# EAGLE design relay_5channel (EAGLE 9.6.1)
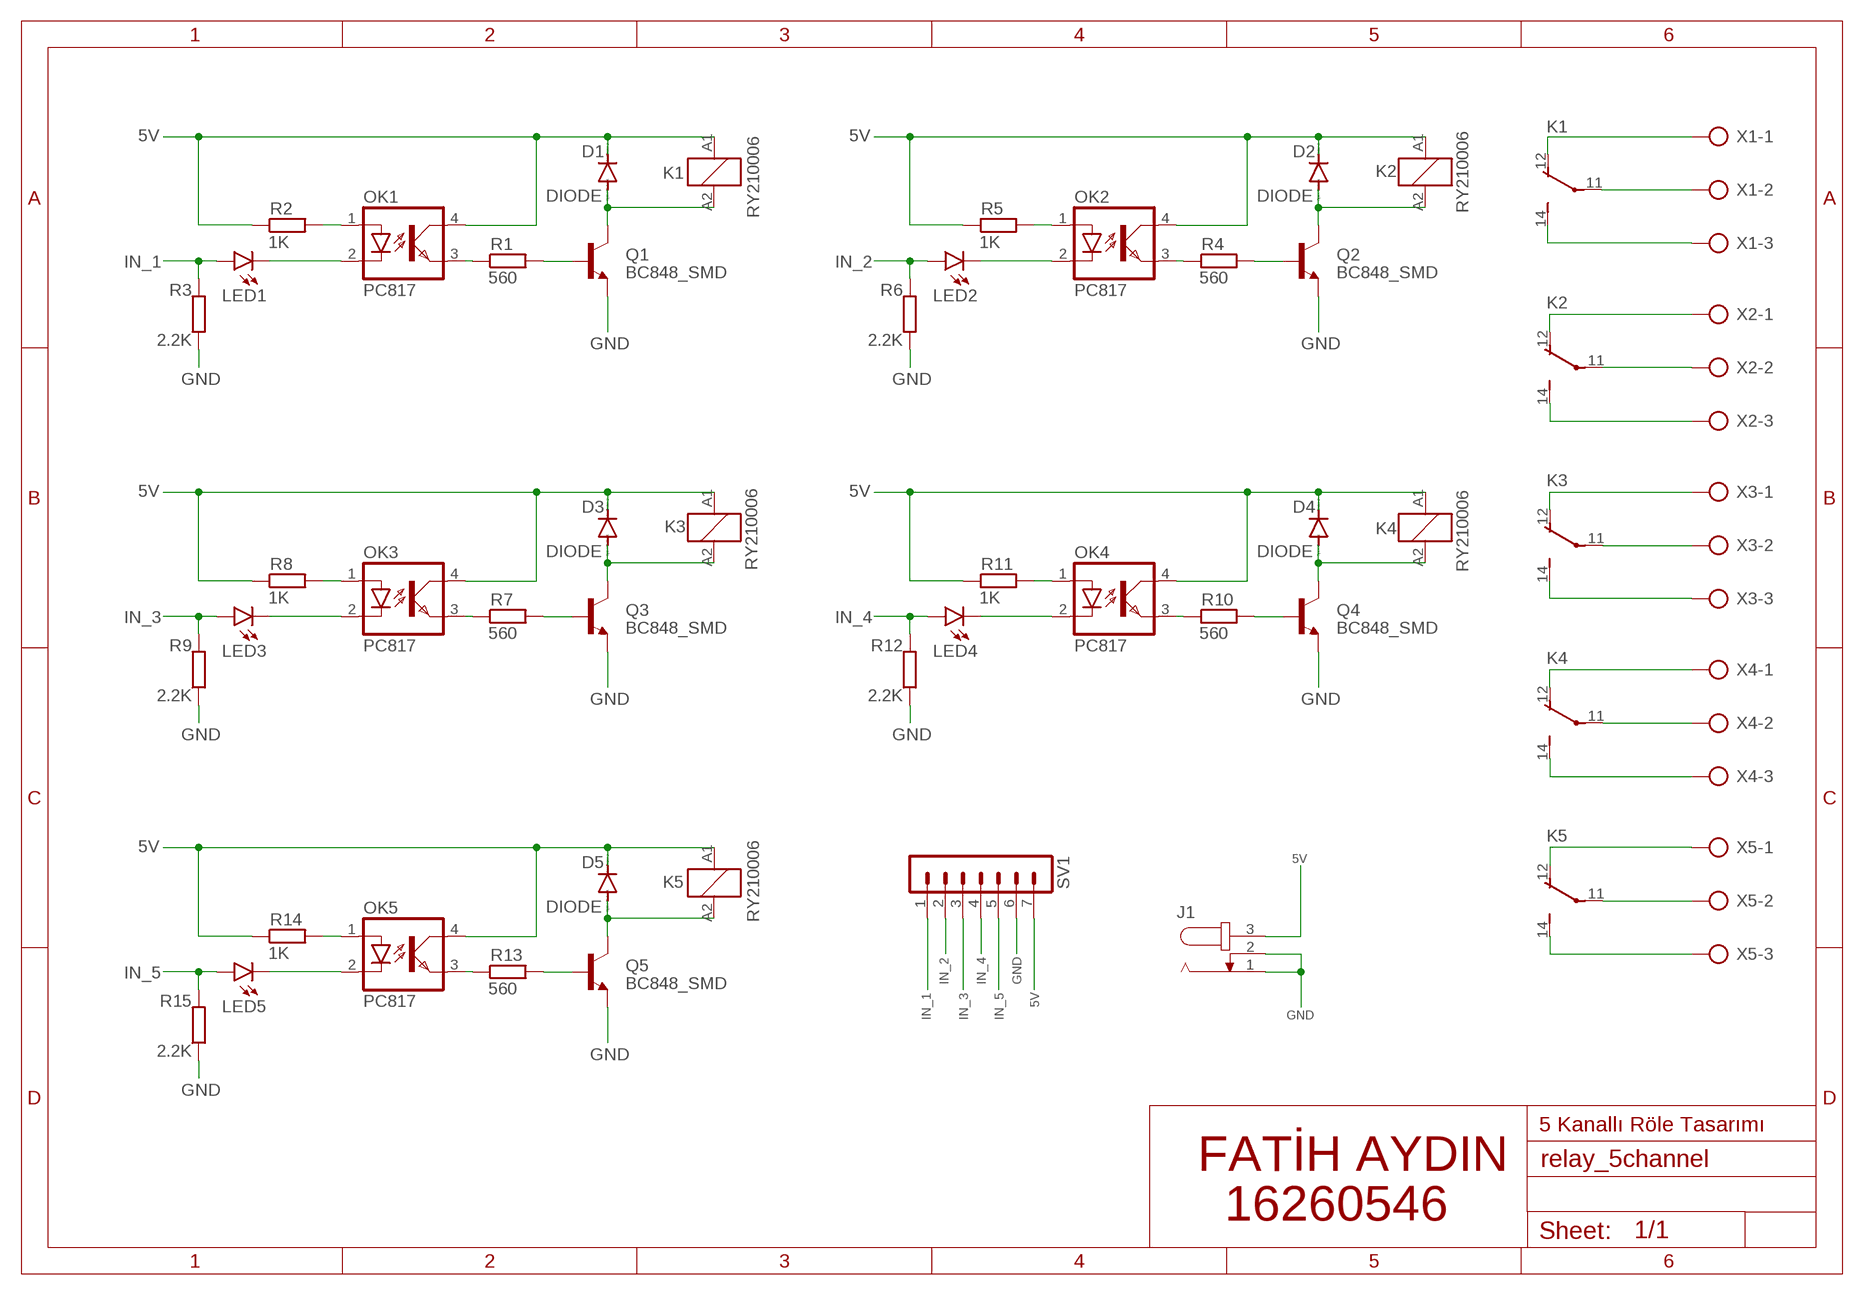
[diagram p0: schematic, sheet 1]

## Parts
D1  DIODE  1N4148DO35-7  [DO35-7]
D2  DIODE  1N4148DO35-7  [DO35-7]
D3  DIODE  1N4148DO35-7  [DO35-7]
D4  DIODE  1N4148DO35-7  [DO35-7]
D5  DIODE  1N4148DO35-7  [DO35-7]
J1  JACK-PLUG1  [SPC4078]
K1  RY210006  [RY-II]
K2  RY210006  [RY-II]
K3  RY210006  [RY-II]
K4  RY210006  [RY-II]
K5  RY210006  [RY-II]
LED1  LEDCHIP-LED0805  [CHIP-LED0805]
LED2  LEDCHIP-LED0805  [CHIP-LED0805]
LED3  LEDCHIP-LED0805  [CHIP-LED0805]
LED4  LEDCHIP-LED0805  [CHIP-LED0805]
LED5  LEDCHIP-LED0805  [CHIP-LED0805]
OK1  PC817  [DIL04]
OK2  PC817  [DIL04]
OK3  PC817  [DIL04]
OK4  PC817  [DIL04]
OK5  PC817  [DIL04]
Q1  BC848_SMD  BC848ALT1SMD  [SOT23]
Q2  BC848_SMD  BC848ALT1SMD  [SOT23]
Q3  BC848_SMD  BC848ALT1SMD  [SOT23]
Q4  BC848_SMD  BC848ALT1SMD  [SOT23]
Q5  BC848_SMD  BC848ALT1SMD  [SOT23]
R1  560  R-EU_M0805  [M0805]
R2  1K  R-EU_0204/5  [0204/5]
R3  2.2K  R-EU_0204/5  [0204/5]
R4  560  R-EU_M0805  [M0805]
R5  1K  R-EU_0204/5  [0204/5]
R6  2.2K  R-EU_0204/5  [0204/5]
R7  560  R-EU_M0805  [M0805]
R8  1K  R-EU_0204/5  [0204/5]
R9  2.2K  R-EU_0204/5  [0204/5]
R10  560  R-EU_M0805  [M0805]
R11  1K  R-EU_0204/5  [0204/5]
R12  2.2K  R-EU_0204/5  [0204/5]
R13  560  R-EU_M0805  [M0805]
R14  1K  R-EU_0204/5  [0204/5]
R15  2.2K  R-EU_0204/5  [0204/5]
SV1  MA07-1  [MA07-1]
X1  AK300/3  [AK300/3]
X2  AK300/3  [AK300/3]
X3  AK300/3  [AK300/3]
X4  AK300/3  [AK300/3]
X5  AK300/3  [AK300/3]

## Nets
5V: D1.C D2.C D3.C D4.C D5.C J1.3 K1.A1 K2.A1 K3.A1 K4.A1 K5.A1 OK1.4(COL) OK2.4(COL) OK3.4(COL) OK4.4(COL) OK5.4(COL) R2.1 R5.1 R8.1 R11.1 R14.1 SV1.7
COM: K1.11(2:P) X1.2
GND: J1.1 J1.2 Q1.2(E) Q2.2(E) Q3.2(E) Q4.2(E) Q5.2(E) R3.1 R6.1 R9.1 R12.1 R15.1 SV1.6
IN_1: LED1.A R3.2 SV1.1
IN_2: LED2.A R6.2 SV1.2
IN_3: LED3.A R9.2 SV1.3
IN_4: LED4.A R12.2 SV1.4
IN_5: LED5.A R15.2 SV1.5
N$1: OK1.1(A) R2.2
N$2: LED1.C OK1.2(C)
N$3: OK2.1(A) R5.2
N$4: Q1.1(B) R1.2
N$5: LED2.C OK2.2(C)
N$6: OK1.3(EMIT) R1.1
N$7: D1.A K1.A2 Q1.3(C)
N$8: OK2.3(EMIT) R4.1
N$9: D2.A K2.A2 Q2.3(C)
N$10: Q2.1(B) R4.2
N$11: OK3.1(A) R8.2
N$12: LED3.C OK3.2(C)
N$13: OK3.3(EMIT) R7.1
N$14: D3.A K3.A2 Q3.3(C)
N$15: Q3.1(B) R7.2
N$16: OK4.1(A) R11.2
N$17: LED4.C OK4.2(C)
N$18: OK4.3(EMIT) R10.1
N$19: D4.A K4.A2 Q4.3(C)
N$20: Q4.1(B) R10.2
N$21: OK5.1(A) R14.2
N$22: LED5.C OK5.2(C)
N$23: OK5.3(EMIT) R13.1
N$24: D5.A K5.A2 Q5.3(C)
N$25: Q5.1(B) R13.2
N$26: K2.11(2:P) X2.2
N$27: K2.14(2:S) X2.3
N$28: K2.12(2:O) X2.1
N$29: K3.12(2:O) X3.1
N$30: K3.14(2:S) X3.3
N$31: K3.11(2:P) X3.2
N$32: K4.12(2:O) X4.1
N$33: K4.14(2:S) X4.3
N$34: K4.11(2:P) X4.2
N$35: K5.11(2:P) X5.2
N$36: K5.12(2:O) X5.1
N$37: K5.14(2:S) X5.3
NC: K1.12(2:O) X1.1
NO: K1.14(2:S) X1.3

## Notes on the sheet
- 5 Kanallı Röle Tasarımı
- FATİH AYDIN
- 16260546

## Library data of the parts
D1-D5 = diode:1N4148: DIODE high speed (Philips)
J1 = con-jack:JACK-PLUG: DC POWER JACK Power Jack, DC, Right Angle, Through Hole, Rated 5A at 16VDC, PC Terminals Distributor: Farnell (www.Farnell.de) Drawing: 84N1161.pdf / 84N1162.pdf Manufacturer: SPC Technology (www.spctechnology.com) Type: SPC4077 / SPC 4078; OC_FARNELL: unknown; OC_NEWARK: unknown
K1-K5 = relay:RY?1*: Miniature Power PCB Relay SCHRACK 1 pole 8 A Source: http://www.schrack.com/.. 5817.pdf; MF: TYCO ELECTRONICS; MPN: RY210006; OC_FARNELL: unknown; OC_NEWARK: 08H3763
LED1-LED5 = led:LED: LED OSRAM: - CHIPLED LG R971, LG N971, LY N971, LG Q971, LY Q971, LO R971, LY R971 LH N974, LH R974 LS Q976, LO Q976, LY Q976 LO Q996 - Hyper CHIPLED LW Q18S LB Q993, LB Q99A, LB R99A - SideLED LS A670, LO A670, LY A670, LG A670, LP A670 LB A673, LV A673, LT A673, LW A673 LH A674 LY A675 LS A676, LA A676, LO A676, LY A676, LW A676 LS A679, LY A679, LG A679 - Hyper Micro SIDELED® LS Y876, LA Y876, LO Y876, LY Y876 LT Y87S - SmartLED LW L88C, LW L88S LB L89C, LB L89S, LG L890 LS L89K, LO L89K, LY L89K LS L896, LA L896, LO L896, LY L896 - TOPLED LS T670, LO T670, LY T670, LG T670, LP T670 LSG T670, LSP T670, LSY T670, LOP T670, LYG T670 LG T671, LOG T671, LSG T671 LB T673, LV T673, LT T673, LW T673 LH T674 LS T676, LA T676, LO T676, LY T676, LB T676, LH T676, LSB T676, LW T676 LB T67C, LV T67C, LT T67C, LS T67K, LO T67K, LY T67K, LW E67C LS E67B, LA E67B, LO E67B, LY E67B, LB E67C, LV E67C, LT E67C LW T67C LS T679, LY T679, LG T679 LS T770, LO T770, LY T770, LG T770, LP T770 LB T773, LV T773, LT T773, LW T773 LH T774 LS E675, LA E675, LY E675, LS T675 LS T776, LA T776, LO T776, LY T776, LB T776 LHGB T686 LT T68C, LB T68C - Hyper Mini TOPLED® LB M676 - Mini TOPLED Santana® LG M470 LS M47K, LO M47K, LY M47K Source: http://www.osram.convergy.de LUXEON: - LUMILED® LXK2-PW12-R00, LXK2-PW12-S00, LXK2-PW14-U00, LXK2-PW14-V00 LXK2-PM12-R00, LXK2-PM12-S00, LXK2-PM14-U00 LXK2-PE12-Q00, LXK2-PE12-R00, LXK2-PE12-S00, LXK2-PE14-T00, LXK2-PE14-U00 LXK2-PB12-K00, LXK2-PB12-L00, LXK2-PB12-M00, LXK2-PB14-N00, LXK2-PB14-P00, LXK2-PB14-Q00 LXK2-PR12-L00, LXK2-PR12-M00, LXK2-PR14-Q00, LXK2-PR14-R00 LXK2-PD12-Q00, LXK2-PD12-R00, LXK2-PD12-S00 LXK2-PH12-R00, LXK2-PH12-S00 LXK2-PL12-P00, LXK2-PL12-Q00, LXK2-PL12-R00 Source: www.luxeon.com KINGBRIGHT: KA-3528ASYC Source: www.kingbright.com
OK1-OK5 = optocoupler:PC817: SHARP OPTO COUPLER; MPN: PC817X4J000F; OC_FARNELL: 9707727; OC_NEWARK: 97K7059
Q1-Q5 = transistor-npn:BC848*: NPN Transistor
R1-R15 = rcl:R-EU_: RESISTOR, European symbol; SPICEPREFIX: R
SV1 = con-lstb:MA07-1: PIN HEADER; OC_FARNELL: unknown; OC_NEWARK: unknown
X1-X5 = con-ptr500:AK300/3: CONNECTOR; OC_FARNELL: unknown; OC_NEWARK: unknown

## Board
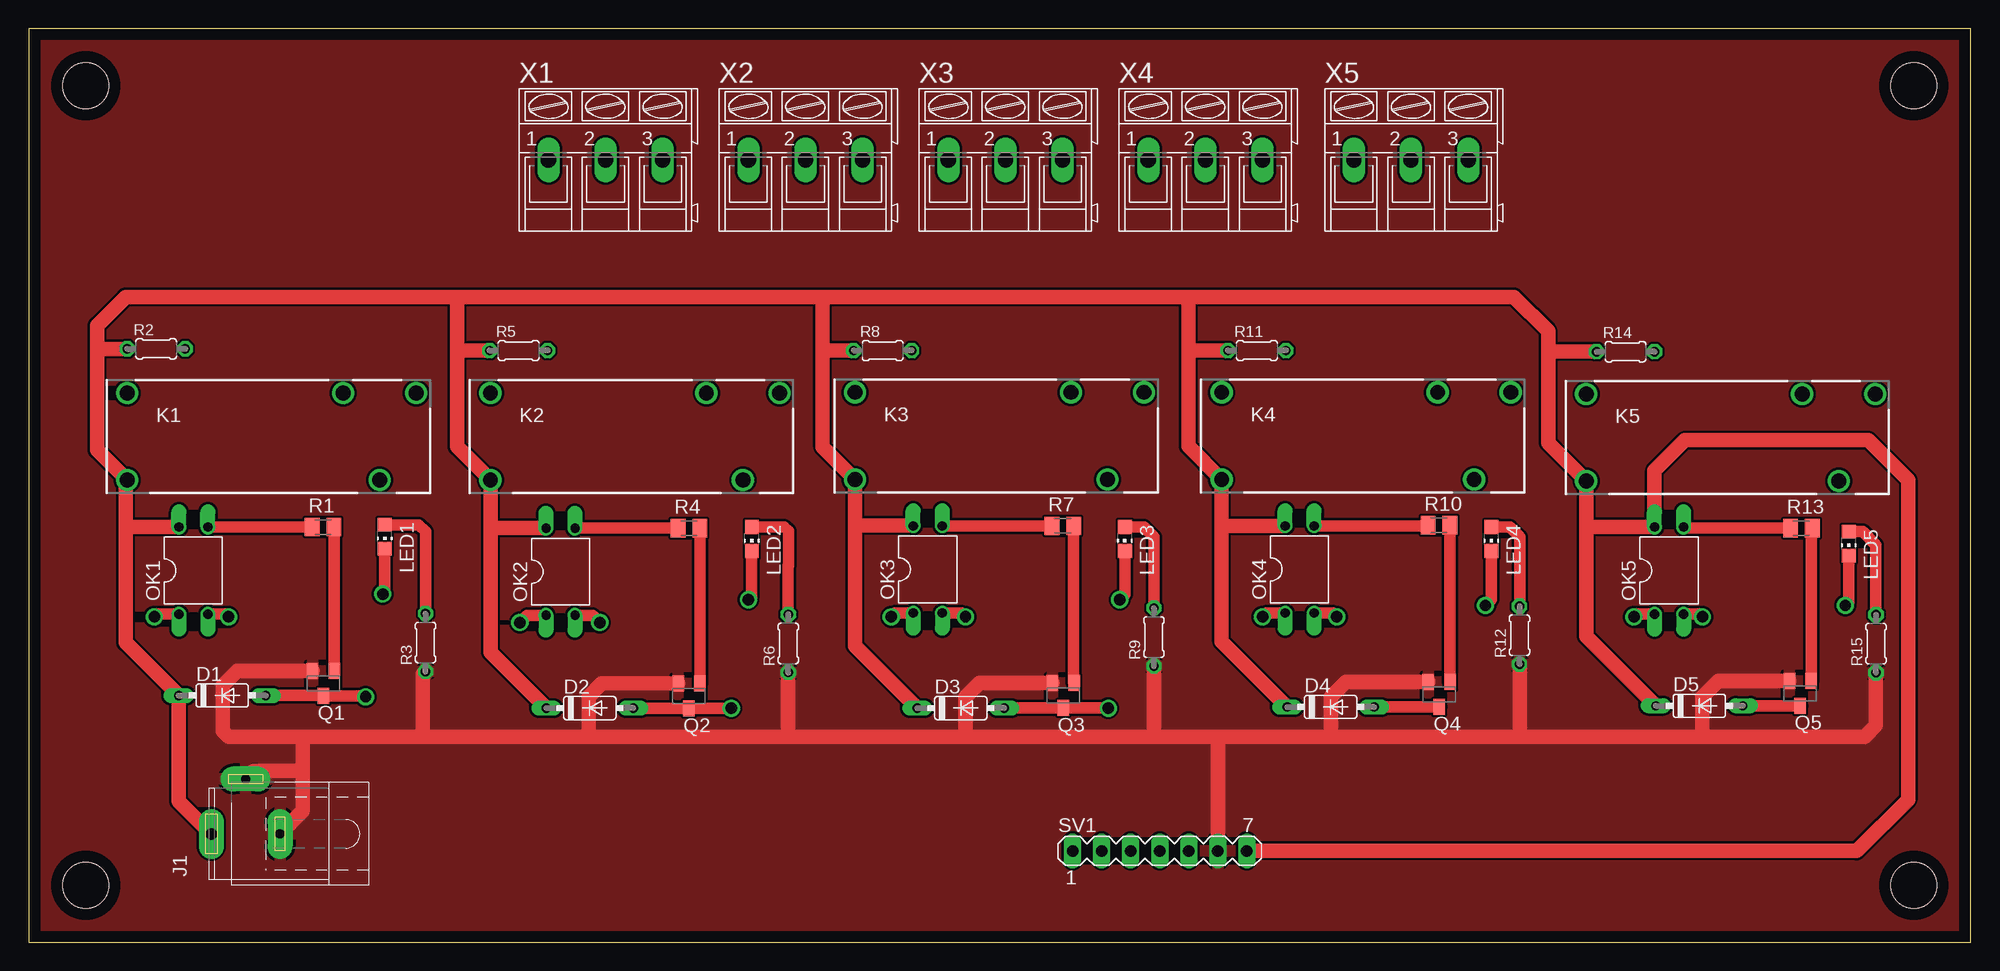
[diagram p1: board, top side]
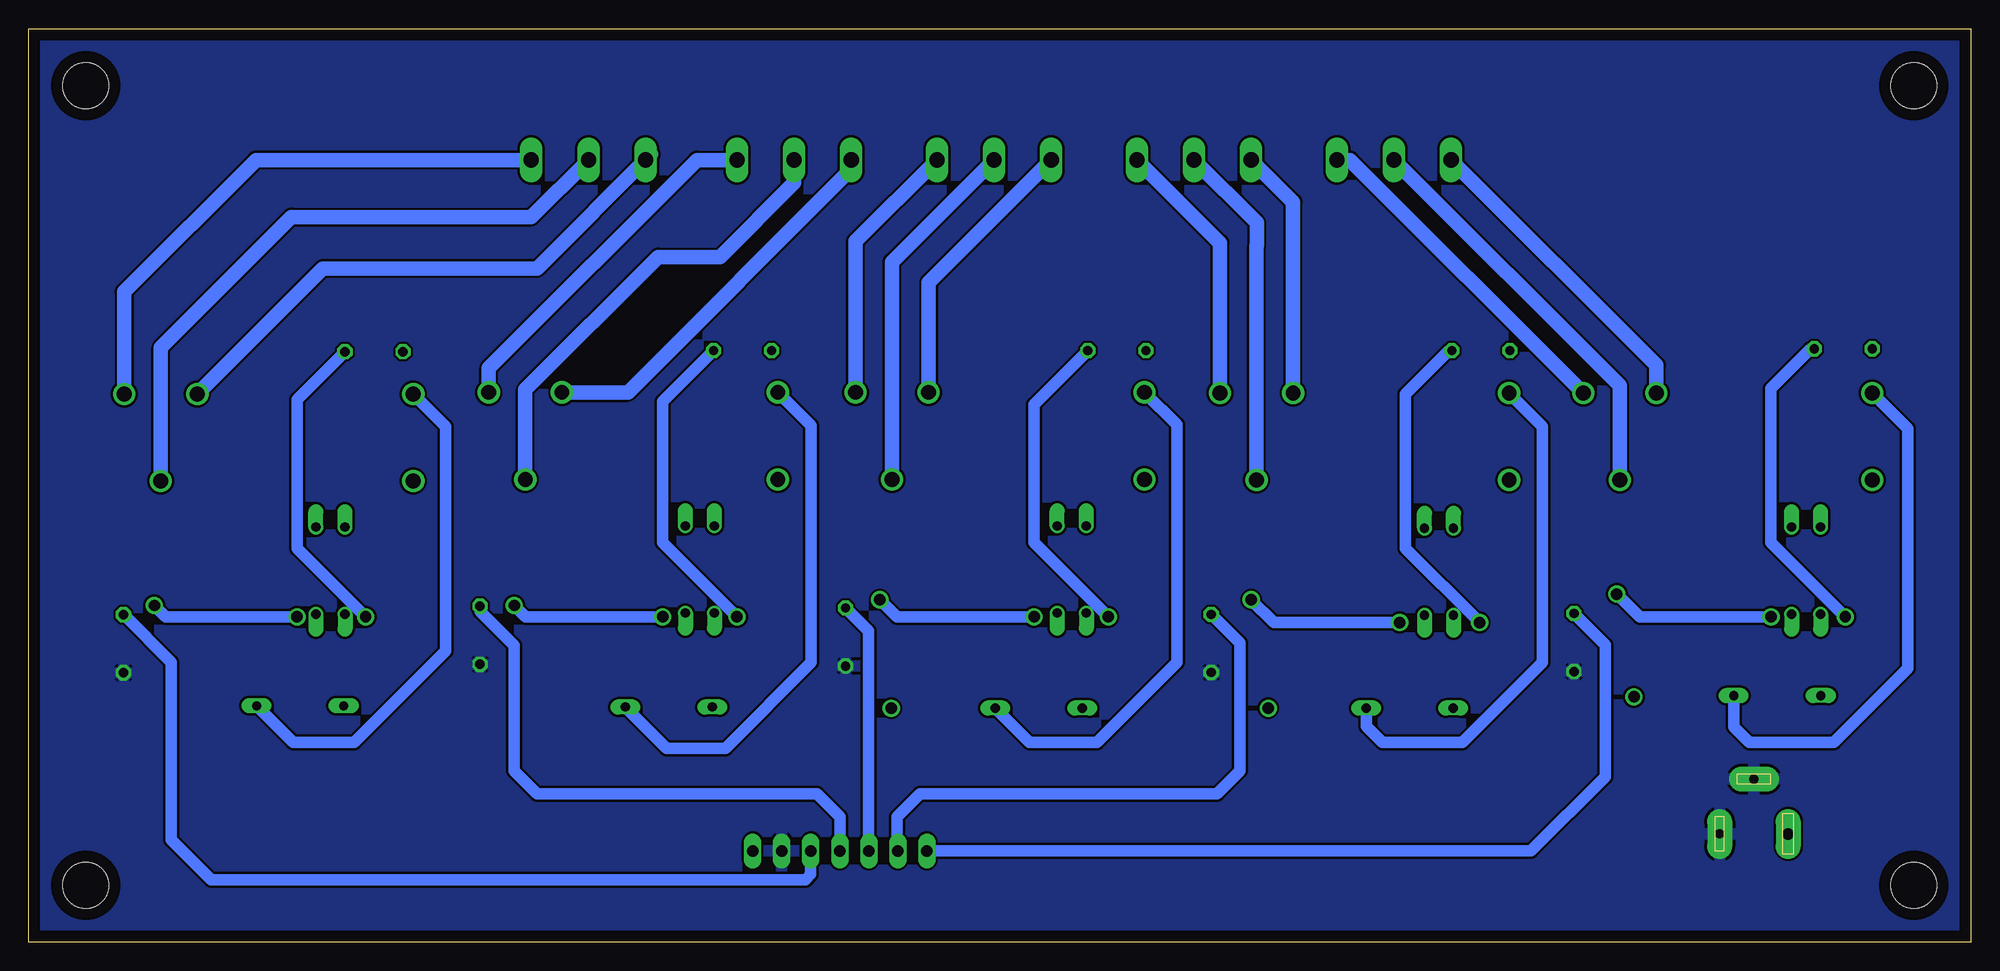
[diagram p2: board, bottom side, seen from below]

Size 170 x 80 mm. Coordinates in mm from the lower left corner, seen from the top.
Outline: 0,0 170,0 170,80 0,80 0,0
Copper layers (1*16): Top 0.035mm / dielectric 1.5mm / Bottom 0.035mm
Design rules "PCBway": minimum track width 6mil, minimum drill 0.3mm, track to track 0.205mm, track to pad 0.205mm, pad to pad 0.205mm, via to via 0.205mm, smd to smd 8mil, copper to edge 40mil, drill to drill 8mil, minimum pad ring 10mil, minimum via ring 8mil, stop-mask expansion 4mil, vias tented up to drill 25mil, thermal gap 10mil
Holes 4 mm at 5,75 165,75 165,5 5,5

### Footprints (pad centres in the part's own frame; a part is rotated, then mirrored left to right if it is on the bottom)
DO35-7 = drill 0.813 long: A 3.81,0; C -3.81,0
SPC4078 = drill 0.8 pad 2.184 long: 1 -3,0; 2 0,-4.8 | drill 1 pad 2.184 long: 3 3,0
RY-II = drill 1.3: 11 9.4,-3.81; 12 6.2,3.81; 14 12.6,3.81; A1 -12.7,-3.81; A2 -12.7,3.81
CHIP-LED0805 = smd 1.2 x 1.2: A 0,-1.05; C 0,1.05
DIL04 = drill 0.813 offset: 1 -1.27,-3.81; 2 1.27,-3.81; 3 1.27,3.81; 4 -1.27,3.81
SOT23 = smd 1 x 1.4: 1 -0.95,-1.1; 2 0.95,-1.1; 3 0,1.1
M0805 = smd 1.3 x 1.6: 1 -0.95,0; 2 0.95,0
0204/5 = drill 0.813 octagon: 1 -2.54,0; 2 2.54,0
MA07-1 = drill 1.016 long: 1 -7.62,0; 2 -5.08,0; 3 -2.54,0; 4 0,0; 5 2.54,0; 6 5.08,0; 7 7.62,0
AK300/3 = drill 1.321 long: 1 -5.004,0; 2 0,0; 3 5.004,0

### Placement (x,y rotation side)
D1  16.95,21.61 0 top
D2  49.12,20.51 0 top
D3  81.59,20.51 0 top
D4  113.96,20.61 0 top
D5  146.23,20.71 0 top
J1  19,9.5 180 top
K1  21.33,44.28 0 top
K2  53.12,44.28 0 top
K3  85.03,44.34 0 top
K4  117.12,44.34 0 top
K5  149.03,44.2 0 top
LED1  31.17,35.51 180 top
LED2  63.29,35.31 180 top
LED3  95.95,35.31 180 top
LED4  128.03,35.31 180 top
LED5  159.31,34.91 180 top
OK1  14.42,32.55 0 top
OK2  46.56,32.45 0 top
OK3  78.7,32.65 0 top
OK4  111.24,32.65 0 top
OK5  143.58,32.55 0 top
Q1  25.8,22.67 180 top
Q2  57.8,21.57 180 top
Q3  90.56,21.61 180 top
Q4  123.46,21.71 180 top
Q5  155.06,21.81 180 top
R1  25.78,36.36 0 top
R2  11.17,51.96 0 top
R3  34.74,26.25 90 top
R4  57.8,36.26 0 top
R5  42.89,51.81 0 top
R6  66.49,26.17 90 top
R7  90.52,36.46 0 top
R8  74.75,51.81 0 top
R9  98.49,26.73 90 top
R10  123.44,36.51 0 top
R11  107.51,51.81 0 top
R12  130.49,26.89 90 top
R13  155.16,36.26 0 top
R14  139.77,51.71 0 top
R15  161.69,26.15 90 top
SV1  99,8 0 top
X1  50.5,68.5 0 top
X2  68,68.5 0 top
X3  85.5,68.5 0 top
X4  103,68.5 0 top
X5  121,68.5 0 top

### Tracks (layer width: path | path; a pad name or v marks a point on that pad's centre or on a via)
5V
  Top 1.27: 8.5,36 8.5,40.34 K1.A1 6,43.1 6,52 | OK1.4 8.86,36.36 8.5,36 | 6,52 6,54 8.5,56.5 37.5,56.5 | D2.C 40.42,25.4 40.42,36 | 40.42,36 K2.A1 37.5,43.39 37.5,52 | OK2.4 40.68,36.26 40.42,36 | 8.5,36 8.5,26.25 D1.C 13.14,12.36 J1.3 | D3.C 72.33,25.96 72.33,36.5 | 72.33,36.5 K3.A1 69.5,43.36 69.5,51.5 | OK3.4 77.39,36.5 72.33,36.5 | D4.C 104.42,26.34 104.42,36.5 | 104.42,36.5 K4.A1 101.5,43.45 101.5,52 | OK4.4 104.46,36.46 104.42,36.5 | D5.C 136.33,26.8 136.33,36.5 | 136.33,36.5 K5.A1 133,43.72 133,51.5 | 133,51.5 133,53.5 130,56.5 101.5,56.5 | 101.5,56.5 69.5,56.5 | 69.5,56.5 37.5,56.5 | R2.1 6.04,51.96 6,52 | 37.5,52 37.5,56.5 | 69.5,51.5 69.5,56.5 | R5.1 37.69,51.81 37.5,52 | R8.1 69.81,51.81 69.5,51.5 | 101.5,52 101.5,56.5 | R11.1 101.69,51.81 101.5,52 | R14.1 133.21,51.71 133,51.5 | SV1.7 160,8 164.5,12.5 164.5,40.5 161.02,43.98 144.98,43.98 142.31,41.31 OK5.4 136.47,36.36 136.33,36.5
COM
  Bottom 1.27: K1.11 30.73,48.73 X1.2
GND
  Top 1.27: Q1.2 18.27,23.77 17,22.5 17,18.5 17.5,18 24,18 | 24,18 34.5,18 | 34.5,18 49,18 | 49,18 66.5,18 | 66.5,18 82,18 | 82,18 98.5,18 | Q2.2 50.17,22.67 49,21.5 49,18 | R3.1 34.5,23.47 34.5,18 | R6.1 66.49,18.01 66.5,18 | Q3.2 83.21,22.71 82,21.5 82,18 | R9.1 98.49,18.01 98.5,18 | 98.5,18 104,18 | 104,18 114,18 | 114,18 130.5,18 | Q4.2 115.31,22.81 114,21.5 114,18 | R12.1 130.5,18 | R15.1 161.69,18.99 160.7,18 146.5,18 | 130.5,18 146.5,18 | Q5.2 147.91,22.91 146.5,21.5 146.5,18 | SV1.6 104.08,17.92 104,18 | J1.1 24,11.5 24,15 | 24,15 24,18 | J1.2 19.7,15 24,15
  pour Top: -2,81.5 -2,-4 172.5,-4 173,-3.5 173,82.5 -1.5,82.5 -2,82
  pour Bottom: -4.5,83.5 -4.5,-6 174.5,-6 175,-5.5 175,84 174.5,84.5 -4.5,84.5
IN_1
  Top 1.016: LED1.A 34.14,36.56 34.74,35.96 R3.2
  Bottom 1.016: R3.2 32,26.05 32,14.5 38.5,8 SV1.1
IN_2
  Top 1.016: LED2.A 66.14,36.36 66.5,36 66.5,33 66.49,32.99 R6.2
  Bottom 1.016: R6.2 64,26.22 64,15 66,13 92,13 94,11 94,8.08 SV1.2
IN_3
  Top 1.016: LED3.A 97.64,36.36 98.5,35.5 R9.2
  Bottom 1.016: R9.2 96.5,27.28 96.5,8.04 SV1.3
IN_4
  Top 1.016: LED4.A 129.64,36.36 130.5,35.5 R12.2
  Bottom 1.016: R12.2 130.49,28.99 127.5,26 127.5,15 125.5,13 101,13 99,11 SV1.4
IN_5
  Top 1.016: LED5.A 160.54,35.96 161.69,34.81 R15.2
  Bottom 1.016: R15.2 157.5,24.5 157.5,15 157.5,14 157.5,9 154,5.5 102,5.5 101.54,5.96 SV1.5
N$1  (via drill 1)
  Top 1.016: OK1.1 11.24,28.74 v11,28.5
  Bottom 1.016: R2.2 14.04,51.96 17.5,48.5 17.5,35 v11,28.5
N$2  (via drill 1)
  Top 1.016: OK1.2 17.26,28.74 v17.5,28.5 | LED1.C 31.17,30.67 v31,30.5
  Bottom 1.016: v31,30.5 29,28.5 v17.5,28.5
N$3  (via drill 1)
  Top 1.016: OK2.1 43.64,28.64 v43,28
  Bottom 1.016: v43,28 49.5,34.5 49.5,48 45.69,51.81 R5.2
N$4
  Top 1.016: R1.2 26.75,36.34 Q1.1
N$5  (via drill 1)
  Top 1.016: OK2.2 49.36,28.64 v50,28 | LED2.C 63.29,30.29 v63,30
  Bottom 1.016: v63,30 61,28 v50,28
N$6
  Top 1.016: R1.1 OK1.3
N$7  (via drill 1)
  Top 1.016: D1.A 25.76,21.61 Q1.3 29.43,21.57 v29.5,21.5
  Bottom 1.016: K1.A2 8.61,48.09 5.52,45 5.52,23.98 12,17.5 19.4,17.5 20.76,18.86 D1.A
N$8
  Top 1.016: OK2.3 R4.1
N$9  (via drill 1)
  Top 1.016: D2.A 52.97,20.47 Q2.3 61.47,20.47 v61.5,20.5
  Bottom 1.016: D2.A 52.93,18.93 51.5,17.5 44.5,17.5 37.5,24.5 37.5,45.17 K2.A2
N$10
  Top 1.016: Q2.1 R4.2
N$11  (via drill 1)
  Top 1.016: OK3.1 75.84,28.84 v75.5,28.5
  Bottom 1.016: v75.5,28.5 82,35 82,47.1 R8.2
N$12  (via drill 1)
  Top 1.016: OK3.2 81.66,28.84 v82,28.5 | LED3.C 95.95,30.45 v95.5,30
  Bottom 1.016: v95.5,30 94,28.5 v82,28.5
N$13
  Top 1.016: R7.1 OK3.3
N$14  (via drill 1)
  Top 1.016: D3.A Q3.3 v94.49,20.51 v94.5,20.5
  Bottom 1.016: D3.A 82.39,17.5 76.5,17.5 69.5,24.5 69.5,45.32 K3.A2
N$15
  Top 1.016: R7.2 91.47,22.75 Q3.1
N$16  (via drill 1)
  Top 1.016: OK4.1 108.34,28.84 v108,28.5
  Bottom 1.016: v108,28.5 114.5,35 114.5,47.36 R11.2
N$17  (via drill 1)
  Top 1.016: LED4.C 128.03,30.03 v127.5,29.5 | OK4.2 114.16,28.84 v114.5,28.5
  Bottom 1.016: v114.5,28.5 126.5,28.5 v127.5,29.5
N$18
  Top 1.016: R10.1 122.44,36.46 OK4.3
N$19
  Top 1.016: Q4.3 D4.A
  Bottom 1.016: D4.A 114.16,17 109,17 101.5,24.5 101.5,45.23 K4.A2
N$20
  Top 1.016: Q4.1 124.41,36.49 R10.2
N$21  (via drill 1)
  Top 1.016: OK5.1 140.74,28.74 v140.5,28.5
  Bottom 1.016: v140.5,28.5 146.5,34.5 146.5,47.52 R14.2
N$22  (via drill 1)
  Top 1.016: LED5.C 159.31,29.81 v159,29.5 | OK5.2 146.26,28.74 v146.5,28.5
  Bottom 1.016: v159,29.5 158,28.5 v146.5,28.5
N$23
  Top 1.016: R13.1 144.95,36.26 OK5.3
N$24
  Top 1.016: Q5.3 D5.A
  Bottom 1.016: D5.A 146.83,17.5 141.5,17.5 133.5,25.5 133.5,45.18 K5.A2
N$25
  Top 1.016: R13.2 156.01,36.16 Q5.1
N$26
  Bottom 1.27: K2.11 62.52,60.98 62.5,61 62.5,63 X2.2
N$27
  Bottom 1.27: K2.14 65.72,61.22 X2.3
N$28
  Bottom 1.27: K2.12 59.32,64.82 X2.1
N$29
  Bottom 1.27: X3.1 91.23,57.77 K3.12
N$30
  Bottom 1.27: K3.14 97.63,61.37 X3.3
N$31
  Bottom 1.27: K3.11 94.43,59.57 X3.2
N$32
  Bottom 1.27: K4.12 117.55,48.15 98,67.7 X4.1
N$33
  Bottom 1.27: K4.14 129.72,50.28 111.5,68.5 X4.3
N$34
  Bottom 1.27: K4.11 126.52,48.38 114.9,60 109.5,60 103,66.5 X4.2
N$35
  Bottom 1.27: K5.11 158.43,52.07 147,63.5 126,63.5 X5.2
N$36
  Bottom 1.27: X5.1 115.5,69 125.5,59 144.24,59 K5.12
N$37
  Bottom 1.27: X5.3 150.1,68.5 161.63,56.97 K5.14
NC
  Bottom 1.27: K1.12 27.53,50.53 X1.1
NO
  Bottom 1.27: K1.14 54.34,68.5 X1.3